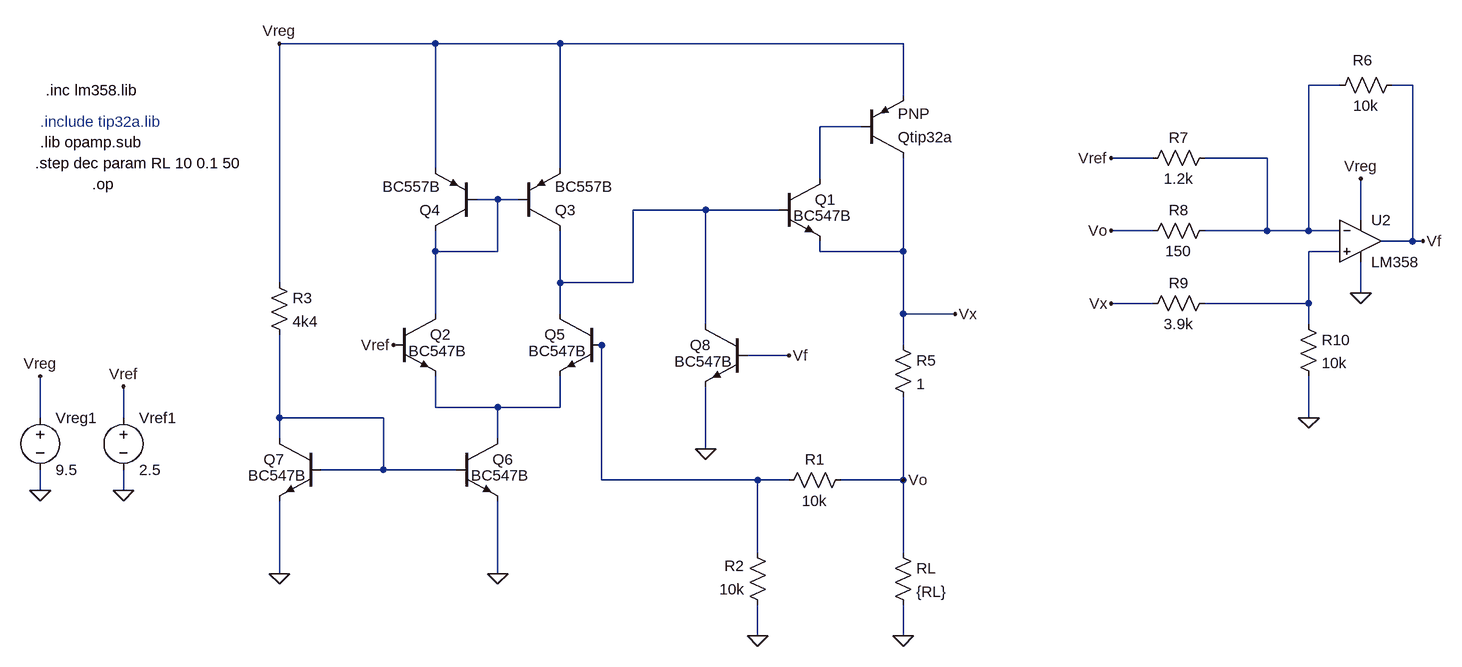
[diagram p0: schematic Foldback_un_opamp.asc]
Foldback_un_opamp.asc, the LTspice schematic file:
Version 4
SHEET 1 1880 680
WIRE 32 -288 -208 -288
WIRE 224 -288 32 -288
WIRE 752 -288 224 -288
WIRE 1424 -224 1376 -224
WIRE 1536 -224 1504 -224
WIRE 752 -208 752 -288
WIRE 688 -160 624 -160
WIRE 1136 -112 1072 -112
WIRE 1312 -112 1216 -112
WIRE 32 -96 32 -288
WIRE 224 -96 224 -288
WIRE 624 -80 624 -160
WIRE 128 -48 96 -48
WIRE 160 -48 128 -48
WIRE 448 -32 336 -32
WIRE 560 -32 448 -32
WIRE 1456 -16 1456 -80
WIRE 1136 0 1072 0
WIRE 1312 0 1312 -112
WIRE 1312 0 1216 0
WIRE 1376 0 1376 -224
WIRE 1376 0 1312 0
WIRE 1424 0 1376 0
WIRE 1536 16 1536 -224
WIRE 1536 16 1488 16
WIRE 1552 16 1536 16
WIRE 32 32 32 0
WIRE 128 32 128 -48
WIRE 128 32 32 32
WIRE 624 32 624 16
WIRE 752 32 752 -112
WIRE 752 32 624 32
WIRE 1424 32 1376 32
WIRE -208 80 -208 -288
WIRE 224 80 224 0
WIRE 336 80 336 -32
WIRE 336 80 224 80
WIRE 1456 96 1456 48
WIRE 1136 112 1072 112
WIRE 1376 112 1376 32
WIRE 1376 112 1216 112
WIRE 32 128 32 32
WIRE 224 128 224 80
WIRE 752 128 752 32
WIRE 832 128 752 128
WIRE 448 144 448 -32
WIRE 1376 144 1376 112
WIRE 288 176 272 176
WIRE 752 176 752 128
WIRE 576 192 512 192
WIRE 32 272 32 224
WIRE 128 272 32 272
WIRE 224 272 224 224
WIRE 224 272 128 272
WIRE -576 288 -576 224
WIRE -448 288 -448 240
WIRE -208 288 -208 160
WIRE -48 288 -208 288
WIRE 1376 288 1376 224
WIRE -208 320 -208 288
WIRE 128 320 128 272
WIRE 448 336 448 240
WIRE -48 368 -48 288
WIRE -48 368 -144 368
WIRE 64 368 -48 368
WIRE 288 384 288 176
WIRE 528 384 288 384
WIRE 576 384 528 384
WIRE 752 384 752 256
WIRE 752 384 656 384
WIRE -576 400 -576 368
WIRE -448 400 -448 368
WIRE 528 496 528 384
WIRE 752 496 752 384
WIRE -208 528 -208 416
WIRE 128 528 128 416
WIRE 528 624 528 576
WIRE 752 624 752 576
FLAG 128 528 0
FLAG -208 528 0
FLAG 752 624 0
FLAG 528 624 0
FLAG -448 400 0
FLAG -32 176 Vref
FLAG -448 240 Vref
FLAG -576 400 0
FLAG -576 224 Vreg
FLAG -208 -288 Vreg
FLAG 752 384 Vo
FLAG 832 128 Vx
FLAG 448 336 0
FLAG 576 192 Vf
FLAG 1552 16 Vf
FLAG 1072 -112 Vref
FLAG 1072 0 Vo
FLAG 1072 112 Vx
FLAG 1376 288 0
FLAG 1456 96 0
FLAG 1456 -80 Vreg
SYMBOL npn -32 128 R0
WINDOW 3 23 57 Left 2
SYMATTR Value BC547B
SYMATTR InstName Q2
SYMBOL pnp 96 0 R180
SYMATTR InstName Q4
SYMATTR Value BC557B
SYMBOL res 672 368 R90
WINDOW 0 0 56 VBottom 2
WINDOW 3 32 56 VTop 2
SYMATTR InstName R1
SYMATTR Value 10k
SYMBOL res 544 592 R180
WINDOW 0 36 76 Left 2
WINDOW 3 36 40 Left 2
SYMATTR InstName R2
SYMATTR Value 10k
SYMBOL res -224 64 R0
SYMATTR InstName R3
SYMATTR Value 4k4
SYMBOL voltage -448 272 R0
WINDOW 123 0 0 Left 0
WINDOW 39 0 0 Left 0
SYMATTR InstName Vref1
SYMATTR Value 2.5
SYMBOL voltage -576 272 R0
WINDOW 123 0 0 Left 0
WINDOW 39 0 0 Left 0
SYMATTR InstName Vreg1
SYMATTR Value 9.5
SYMBOL res 736 480 R0
SYMATTR InstName RL
SYMATTR Value {RL}
SYMBOL pnp 688 -112 M180
SYMATTR InstName Qtip32a
SYMBOL res 736 160 R0
SYMATTR InstName R5
SYMATTR Value 1
SYMBOL res 1520 -240 R90
WINDOW 0 -7 61 VBottom 2
WINDOW 3 32 56 VTop 2
SYMATTR InstName R6
SYMATTR Value 10k
SYMBOL res 1232 -128 R90
WINDOW 0 0 56 VBottom 2
WINDOW 3 32 56 VTop 2
SYMATTR InstName R7
SYMATTR Value 1.2k
SYMBOL res 1232 -16 R90
WINDOW 0 0 56 VBottom 2
WINDOW 3 32 56 VTop 2
SYMATTR InstName R8
SYMATTR Value 150
SYMBOL res 1232 96 R90
WINDOW 0 0 56 VBottom 2
WINDOW 3 32 56 VTop 2
SYMATTR InstName R9
SYMATTR Value 3.9k
SYMBOL res 1360 128 R0
SYMATTR InstName R10
SYMATTR Value 10k
SYMBOL OpAmps\\opamp2 1456 -48 R0
SYMATTR InstName U2
SYMATTR Value LM358
SYMBOL pnp 160 0 M180
SYMATTR InstName Q3
SYMATTR Value BC557B
SYMBOL npn 288 128 M0
WINDOW 3 23 57 Left 2
SYMATTR Value BC547B
SYMATTR InstName Q5
SYMBOL npn 64 320 R0
WINDOW 3 23 57 Left 2
SYMATTR Value BC547B
SYMATTR InstName Q6
SYMBOL npn -144 320 M0
WINDOW 3 23 57 Left 2
SYMATTR Value BC547B
SYMATTR InstName Q7
SYMBOL npn 560 -80 R0
WINDOW 3 23 57 Left 2
SYMATTR Value BC547B
SYMATTR InstName Q1
SYMBOL npn 512 144 M0
WINDOW 3 23 57 Left 2
SYMATTR Value BC547B
SYMATTR InstName Q8
TEXT -496 -72 Left 2 !.op
TEXT -584 -104 Left 2 !.step dec param RL 10 0.1 50
TEXT -576 -168 Left 2 ;.include tip32a.lib
TEXT -576 -136 Left 2 !.lib opamp.sub
TEXT -568 -216 Left 2 !.inc lm358.lib

The netlist it stands for:
* Foldback_un_opamp.asc
Q2 N003 Vref N007 0 BC547B
Q4 N003 N003 Vreg 0 BC557B
R1 Vo N006 10k
R2 0 N006 10k
R3 Vreg N008 4k4
Vref1 Vref 0 2.5
Vreg1 Vreg 0 9.5
RL Vo 0 {RL}
Qtip32a Vx N002 Vreg 0 PNP
R5 Vx Vo 1
R6 Vf N001 10k
R7 N001 Vref 1.2k
R8 N001 Vo 150
R9 N005 Vx 3.9k
R10 N005 0 10k
XU2 N005 N001 Vreg 0 Vf LM358  ; pins In+ In- V+ V- OUT
Q3 N004 N003 Vreg 0 BC557B
Q5 N004 N006 N007 0 BC547B
Q6 N007 N008 0 0 BC547B
Q7 N008 N008 0 0 BC547B
Q1 N002 N004 Vx 0 BC547B
Q8 N004 Vf 0 0 BC547B
.model NPN NPN
.model PNP PNP
.lib standard.bjt
.op
.step dec param RL 10 0.1 50
* .include tip32a.lib
.lib opamp.sub
.inc lm358.lib
.backanno
.end